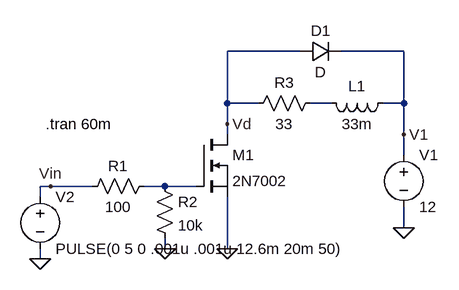
[diagram p0: schematic 2n7002.asc]
2n7002.asc, the LTspice schematic file:
Version 4
SHEET 1 880 680
WIRE 288 0 176 0
WIRE 448 0 352 0
WIRE 176 80 176 0
WIRE 224 80 176 80
WIRE 336 80 304 80
WIRE 448 80 448 0
WIRE 448 80 416 80
WIRE 176 112 176 80
WIRE 176 128 176 112
WIRE 448 128 448 80
WIRE 448 160 448 128
WIRE -96 208 -112 208
WIRE -32 208 -96 208
WIRE 80 208 48 208
WIRE 128 208 80 208
WIRE -112 224 -112 208
WIRE 448 272 448 240
WIRE 80 304 80 288
WIRE 176 304 176 224
WIRE -112 320 -112 304
FLAG 80 304 0
FLAG 176 304 0
FLAG 448 272 0
FLAG -112 320 0
FLAG -96 208 Vin
FLAG 176 112 Vd
FLAG 448 128 V1
SYMBOL nmos 128 128 R0
SYMATTR InstName M1
SYMATTR Value 2N7002
SYMBOL res 64 192 R90
WINDOW 0 0 56 VBottom 2
WINDOW 3 32 56 VTop 2
SYMATTR InstName R1
SYMATTR Value 100
SYMBOL res 64 192 R0
SYMATTR InstName R2
SYMATTR Value 10k
SYMBOL voltage 448 144 R0
WINDOW 123 0 0 Left 0
WINDOW 39 0 0 Left 0
SYMATTR InstName V1
SYMATTR Value 12
SYMBOL voltage -112 208 R0
WINDOW 123 0 0 Left 0
WINDOW 39 0 0 Left 0
SYMATTR InstName V2
SYMATTR Value PULSE(0 5 0 .001u .001u 12.6m 20m 50)
SYMBOL res 320 64 R90
WINDOW 0 0 56 VBottom 2
WINDOW 3 32 56 VTop 2
SYMATTR InstName R3
SYMATTR Value 33
SYMATTR SpiceLine tol=1 pwr=0.1
SYMBOL ind 432 64 R90
WINDOW 0 5 56 VBottom 2
WINDOW 3 32 56 VTop 2
SYMATTR InstName L1
SYMATTR Value 33m
SYMBOL diode 288 16 R270
WINDOW 0 32 32 VTop 2
WINDOW 3 0 32 VBottom 2
SYMATTR InstName D1
TEXT -104 112 Left 2 !.tran 60m

The netlist it stands for:
* 2n7002.asc
M1 Vd N002 0 0 2N7002
R1 N002 Vin 100
R2 N002 0 10k
V1 V1 0 12
V2 Vin 0 PULSE(0 5 0 .001u .001u 12.6m 20m 50)
R3 N001 Vd 33 tol=1 pwr=0.1
L1 V1 N001 33m
D1 Vd V1 D
.model D D
.lib standard.dio
.model NMOS NMOS
.model PMOS PMOS
.lib standard.mos
.tran 60m
.backanno
.end

* Results of the author's LTspice run, read from the files saved beside the schematic
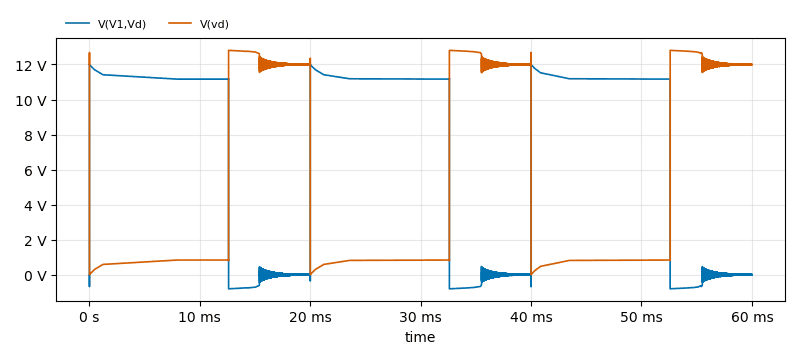
[diagram p1: Transient Analysis of 2n7002.asc, plotted from the saved traces]
* Transient Analysis, 1 run:
*   V(V1,Vd): min -805.8 mV, max 12 V, average 6.972 V, rms 8.92 V, last 5.699 mV
*   V(vd): min 108.3 µV, max 12.81 V, average 5.028 V, rms 7.499 V, last 11.99 V